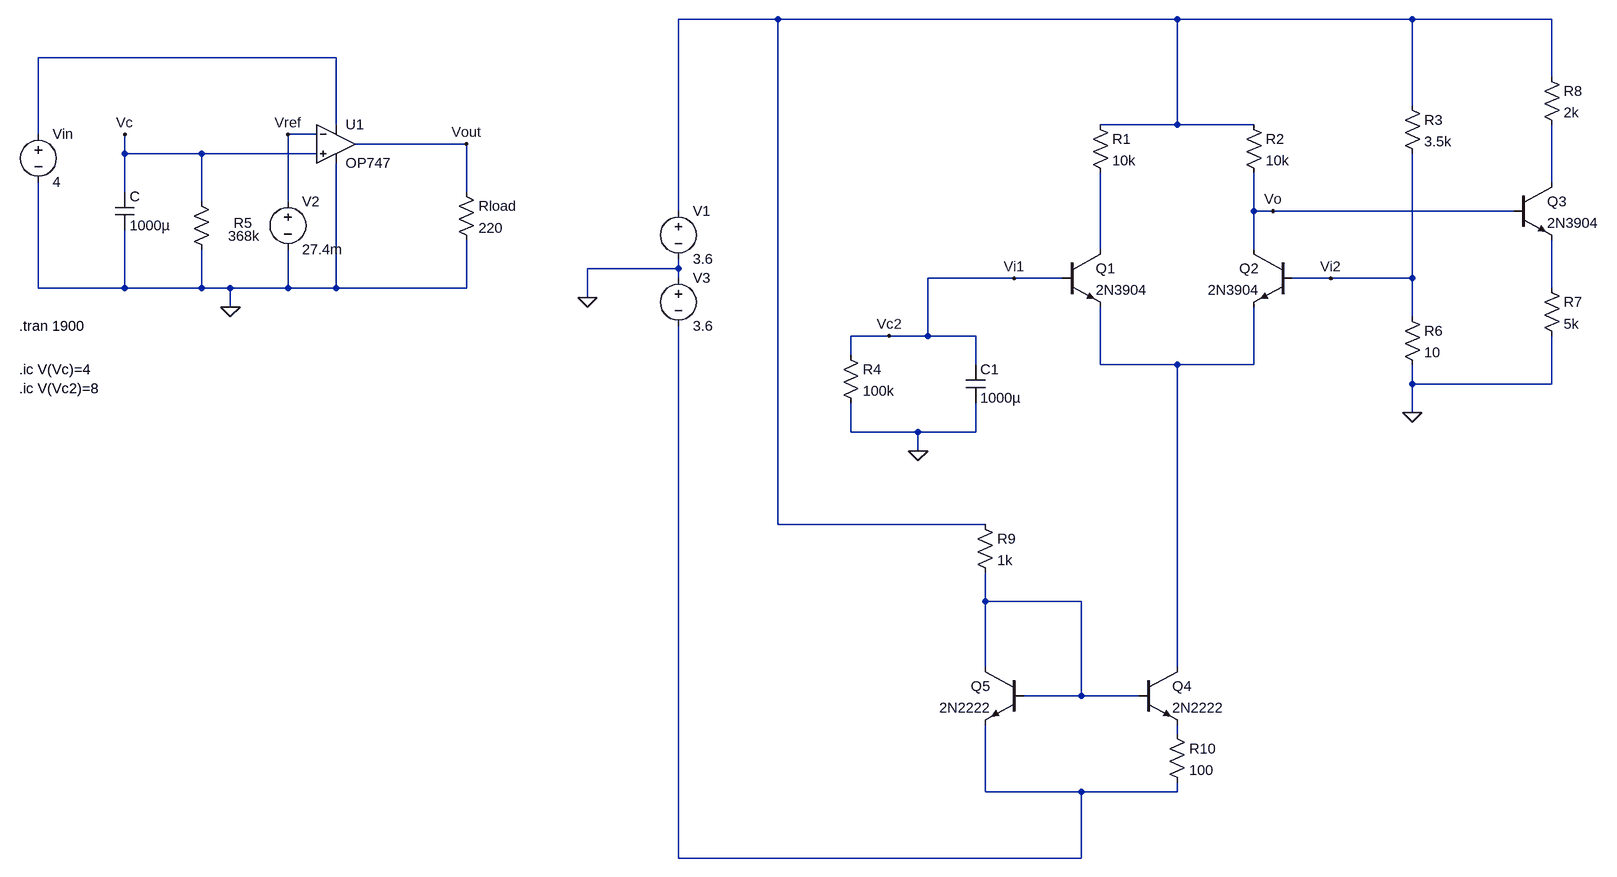
[diagram p0: schematic Draft11.asc]
Draft11.asc, the LTspice schematic file:
Version 4
SHEET 1 5888 1544
WIRE 2336 -128 1888 -128
WIRE 3248 -128 2336 -128
WIRE 3680 -128 3248 -128
WIRE 4096 -128 3680 -128
WIRE 192 -64 -304 -64
WIRE 4096 -32 4096 -128
WIRE 3680 16 3680 -128
WIRE 192 48 192 -64
WIRE 3248 48 3248 -128
WIRE 3248 48 3120 48
WIRE 3376 48 3248 48
WIRE -304 64 -304 -64
WIRE 160 64 112 64
WIRE 448 80 224 80
WIRE -160 96 -160 64
WIRE -32 96 -160 96
WIRE 160 96 -32 96
WIRE 4096 144 4096 48
WIRE -160 160 -160 96
WIRE 448 160 448 80
WIRE -32 176 -32 96
WIRE 112 176 112 64
WIRE 1888 192 1888 -128
WIRE 3376 192 3376 128
WIRE 3408 192 3376 192
WIRE 4032 192 3408 192
WIRE 3120 256 3120 128
WIRE 3376 256 3376 192
WIRE 1888 288 1888 272
WIRE 1888 288 1728 288
WIRE 1888 304 1888 288
WIRE 2976 304 2832 304
WIRE 3056 304 2976 304
WIRE 3504 304 3440 304
WIRE 3680 304 3680 96
WIRE 3680 304 3504 304
WIRE -304 320 -304 144
WIRE -160 320 -160 224
WIRE -160 320 -304 320
WIRE -32 320 -32 256
WIRE -32 320 -160 320
WIRE 16 320 -32 320
WIRE 112 320 112 256
WIRE 112 320 16 320
WIRE 192 320 192 112
WIRE 192 320 112 320
WIRE 448 320 448 240
WIRE 448 320 192 320
WIRE 4096 320 4096 240
WIRE 1728 336 1728 288
WIRE 16 352 16 320
WIRE 3680 368 3680 304
WIRE 2768 400 2704 400
WIRE 2832 400 2832 304
WIRE 2832 400 2768 400
WIRE 2912 400 2832 400
WIRE 2704 432 2704 400
WIRE 2912 448 2912 400
WIRE 3120 448 3120 352
WIRE 3248 448 3120 448
WIRE 3376 448 3376 352
WIRE 3376 448 3248 448
WIRE 3680 480 3680 448
WIRE 4096 480 4096 400
WIRE 4096 480 3680 480
WIRE 3680 528 3680 480
WIRE 2704 560 2704 512
WIRE 2816 560 2704 560
WIRE 2912 560 2912 512
WIRE 2912 560 2816 560
WIRE 2816 592 2816 560
WIRE 2336 848 2336 -128
WIRE 2928 848 2336 848
WIRE 2928 976 2928 928
WIRE 3088 976 2928 976
WIRE 2928 1104 2928 976
WIRE 3248 1104 3248 448
WIRE 3088 1152 3088 976
WIRE 3088 1152 2992 1152
WIRE 3184 1152 3088 1152
WIRE 3248 1216 3248 1200
WIRE 2928 1312 2928 1200
WIRE 3088 1312 2928 1312
WIRE 3248 1312 3248 1296
WIRE 3248 1312 3088 1312
WIRE 1888 1536 1888 384
WIRE 3088 1536 3088 1312
WIRE 3088 1536 1888 1536
FLAG 16 352 0
FLAG -160 64 Vc
FLAG 448 80 Vout
FLAG 112 64 Vref
FLAG 3408 192 Vo
FLAG 2976 304 Vi1
FLAG 3504 304 Vi2
FLAG 2816 592 0
FLAG 2768 400 Vc2
FLAG 3680 528 0
FLAG 1728 336 0
SYMBOL cap -176 160 R0
WINDOW 39 24 86 Left 2
SYMATTR InstName C
SYMATTR Value 1000µ
SYMBOL voltage -304 48 R0
SYMATTR InstName Vin
SYMATTR Value 4
SYMBOL res 432 144 R0
SYMATTR InstName Rload
SYMATTR Value 220
SYMBOL OpAmps\\OP747 192 16 R0
SYMATTR InstName U1
SYMBOL npn 3440 256 M0
SYMATTR InstName Q2
SYMATTR Value 2N3904
SYMBOL res 3104 32 R0
SYMATTR InstName R1
SYMATTR Value 10k
SYMBOL res 3360 32 R0
SYMATTR InstName R2
SYMATTR Value 10k
SYMBOL res -16 272 R180
WINDOW 0 -68 60 Left 2
WINDOW 3 -81 38 Left 2
SYMATTR InstName R5
SYMATTR Value 368k
SYMBOL voltage 112 160 R0
SYMATTR InstName V2
SYMATTR Value 27.4m
SYMBOL res 3664 0 R0
SYMATTR InstName R3
SYMATTR Value 3.5k
SYMBOL npn 3056 256 R0
SYMATTR InstName Q1
SYMATTR Value 2N3904
SYMBOL res 2688 416 R0
SYMATTR InstName R4
SYMATTR Value 100k
SYMBOL cap 2896 448 R0
SYMATTR InstName C1
SYMATTR Value 1000µ
SYMBOL res 3664 352 R0
SYMATTR InstName R6
SYMATTR Value 10
SYMBOL voltage 1888 176 R0
SYMATTR InstName V1
SYMATTR Value 3.6
SYMBOL voltage 1888 288 R0
SYMATTR InstName V3
SYMATTR Value 3.6
SYMBOL npn 4032 144 R0
SYMATTR InstName Q3
SYMATTR Value 2N3904
SYMBOL res 4080 -48 R0
SYMATTR InstName R8
SYMATTR Value 2k
SYMBOL npn 3184 1104 R0
SYMATTR InstName Q4
SYMATTR Value 2N2222
SYMBOL npn 2992 1104 M0
SYMATTR InstName Q5
SYMATTR Value 2N2222
SYMBOL res 2912 832 R0
SYMATTR InstName R9
SYMATTR Value 1k
SYMBOL res 4080 304 R0
SYMATTR InstName R7
SYMATTR Value 5k
SYMBOL res 3232 1200 R0
SYMATTR InstName R10
SYMATTR Value 100
TEXT -336 384 Left 2 !.tran 1900
TEXT -336 456 Left 2 !.ic V(Vc)=4
TEXT -336 488 Left 2 !.ic V(Vc2)=8

The netlist it stands for:
* Draft11.asc
C Vc 0 1000µ
Vin N002 0 4
Rload Vout 0 220
XU1 Vc Vref N002 0 Vout OP747  ; pins In+ In- V+ V- OUT
Q2 Vo Vi2 N006 0 2N3904
R1 N001 N004 10k
R2 N001 Vo 10k
R5 0 Vc 368k
V2 Vref 0 27.4m
R3 N001 Vi2 3.5k
Q1 N004 Vc2 N006 0 2N3904
R4 Vc2 0 100k
C1 Vc2 0 1000µ
R6 Vi2 0 10
V1 N001 0 3.6
V3 0 N009 3.6
Q3 N003 Vo N005 0 2N3904
R8 N001 N003 2k
Q4 N006 N007 N008 0 2N2222
Q5 N007 N007 N009 0 2N2222
R9 N001 N007 1k
R7 N005 0 5k
R10 N008 N009 100
.model NPN NPN
.model PNP PNP
.lib standard.bjt
.tran 1900
.ic V(Vc)=4
.ic V(Vc2)=8
.backanno
.end